# EAGLE design LB_BIT_o13_FAN-v02(rev1) (EAGLE 6.6.0)
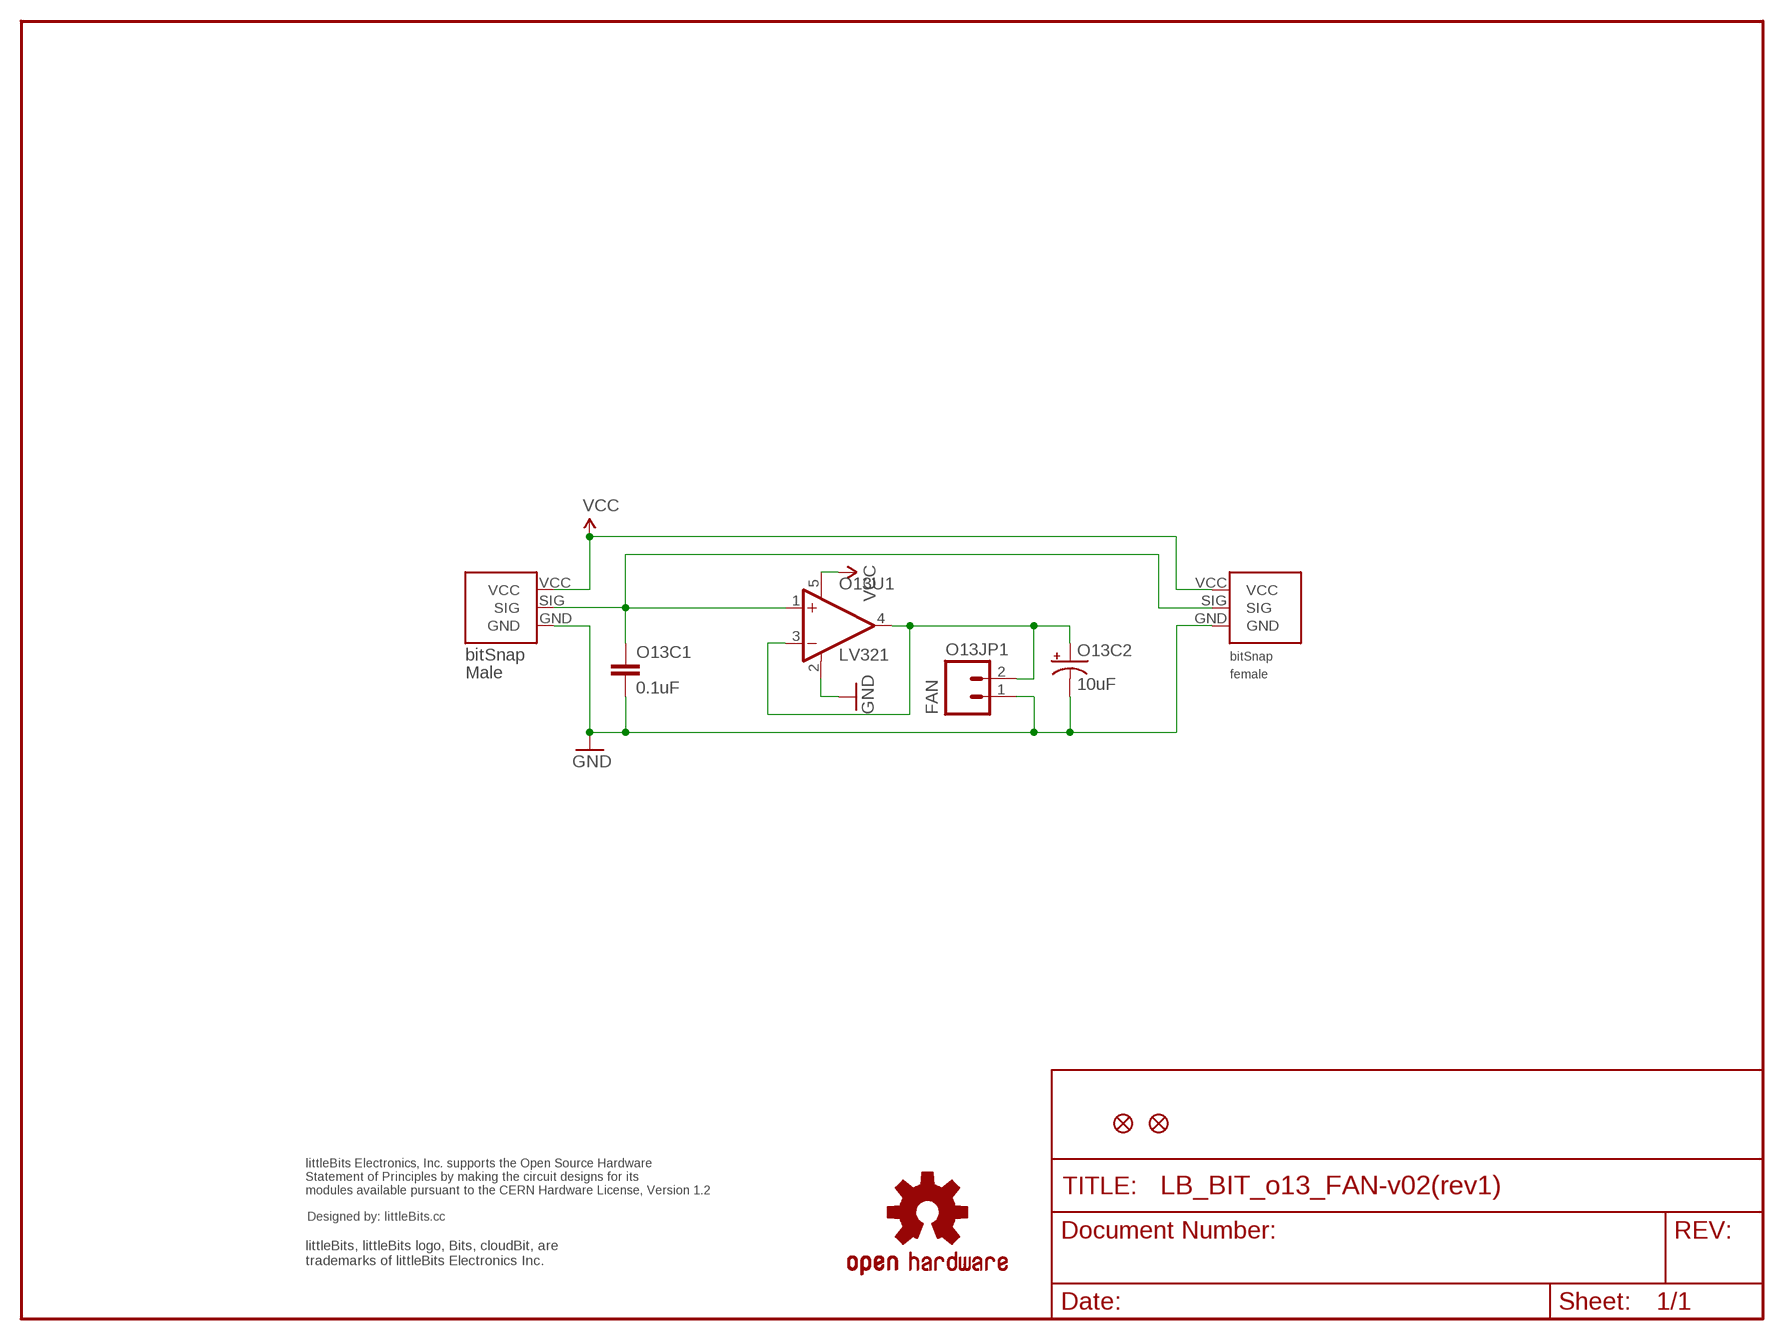
[diagram p0: schematic, sheet 1]

## Parts
JP2  FIDUCIAL1X2  [FIDUCIAL-1X2]
JP3  FIDUCIAL1X2  [FIDUCIAL-1X2]
O13BSF  BITSNAP_FEMALE  [BITSNAP_FEMALE]
O13BSM  BITSNAP_MALE  [BITSNAP_MALE]
O13C1  0.1uF  CAP0603-CAP  [0603-CAP]
O13C2  10uF  CAP_POL1206  [EIA3216]
O13JP1  FAN  M02PTH  [1X02]
O13U1  LV321  [SC70-5]
U$1  OSHWCREDIT  [OSHWCREDIT]
U$5  OSHW-LOGOL  [OSHW-LOGO-L]

## Nets
GND: O13BSF.GND O13BSM.GND O13C1.2 O13C2.C(-) O13JP1.1 O13U1.2(V-)
N$2: O13C2.A(+) O13JP1.2 O13U1.3(-IN) O13U1.4(OUT)
SIG: O13BSF.SIG O13BSM.SIG O13C1.1 O13U1.1(+IN)
VCC: O13BSF.VCC O13BSM.VCC O13U1.5(V+)

## Library data of the parts
JP2 JP3 = SparkFun:FIDUCIAL: Fiducial Alignment Points Various fiducial points for machine vision alignment.
O13BSF = bitSnap:BITSNAP_FEMALE
O13BSM = bitSnap:BITSNAP_MALE
O13C1 = SparkFun:CAP: Capacitor Standard 0603 ceramic capacitor, and 0.1" leaded capacitor.
O13C2 = SparkFun:CAP_POL: Capacitor Polarized These are standard SMD and PTH capacitors. Normally 10uF, 47uF, and 100uF in electrolytic and tantalum varieties. Always verify the external diameter of the through hole cap, it varies with capacity, voltage, and manufacturer. The EIA devices should be standard.
O13JP1 = SparkFun:M02: Header 2 Standard 2-pin 0.1" header. Use with straight break away headers (SKU : PRT-00116), right angle break away headers (PRT-00553), swiss pins (PRT-00743), machine pins (PRT-00117), and female headers (PRT-00115). Molex polarized connector foot print use with SKU : PRT-08233 with associated crimp pins and housings.
O13U1 = LITTLEBITS:LV321
U$1 = LITTLEBITS:OSHWCREDIT
U$5 = SparkFun_NEW:OSHW-LOGO: Open Source Hardware Logo This logo indicates the piece of hardware it is found on incorporates a OSHW license and/or adheres to the definition of open source hardware found here: http://freedomdefined.org/OSHW

## Board
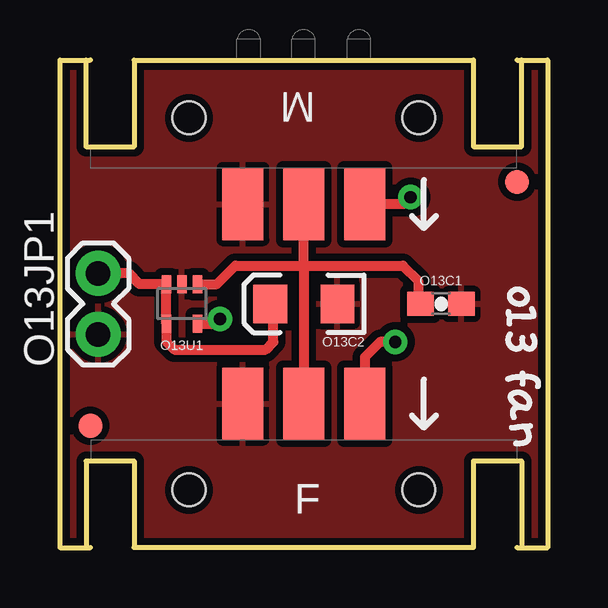
[diagram p1: board, top side]
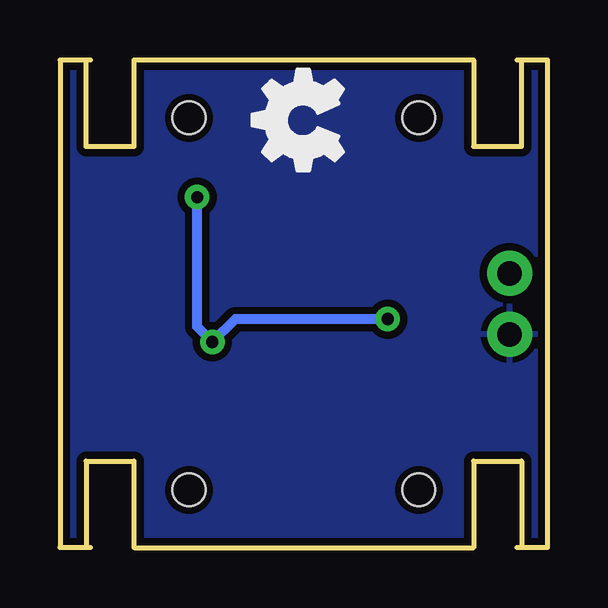
[diagram p2: board, bottom side, seen from below]

Size 20.32 x 20.32 mm. Coordinates in mm from the lower left corner, seen from the top.
Outline: 1.27,0 0,0 0,20.32 1.27,20.32
Outline: 19.05,0 20.32,0 20.32,20.32 19.05,20.32
Copper layers (1*16): Top 0.035mm / dielectric 1.5mm / Bottom 0.035mm
Design rules "default": minimum track width 8mil, minimum drill 20mil, track to track 8mil, track to pad 8mil, pad to pad 8mil, via to via 8mil, smd to smd 8mil, copper to edge 10mil, drill to drill 8mil, minimum pad ring 12mil, minimum via ring 10mil, stop-mask expansion 4mil, vias tented up to drill 25mil, thermal gap 10mil

### Footprints (pad centres in the part's own frame; a part is rotated, then mirrored left to right if it is on the bottom)
FIDUCIAL-1X2 = smd 1 x 1: 1 0,0
BITSNAP_FEMALE = smd 1.7 x 3: GND 6.35,6; SIG 8.89,6; VCC 11.43,6 | hole 1.37: 13.68,2.41; 4.1,2.41
BITSNAP_MALE = smd 1.7 x 3: GND 11.43,6; SIG 8.89,6; VCC 6.35,6 | hole 1.37: 13.68,2.41; 4.1,2.41
0603-CAP = smd 1.1 x 1: 1 -0.85,0; 2 0.85,0
EIA3216 = smd 1.4 x 1.6: A 1.4,0; C -1.4,0
1X02 = drill 1.016 pad 1.88: 1 0,0; 2 2.54,0
SC70-5 = smd 0.4 x 0.75: 1 -0.65,-0.825; 2 0,-0.825; 3 0.65,-0.825; 4 0.65,0.825; 5 -0.65,0.825

### Placement (x,y rotation side)
JP2  19.05,15.24 0 top
JP3  1.27,5.08 0 top
O13BSF  1.27,0 0 top
O13BSM  19.05,20.32 180 top
O13C1  15.88,10.16 0 top
O13C2  10.16,10.16 180 top
O13JP1  1.59,8.89 90 top
O13U1  5.08,10.16 180 top
U$1  -17.78,-21.59 0 top  (outside the outline)
U$2  [O]  18.54,11.05 270 top
U$3  [1]  18.54,10.16 270 top
U$5  -13.97,-8.89 0 top  (outside the outline)
U$6  [OSHW_FILLX150_NOTEXT]  8.51,14.86 0 top
U$7  [3]  18.54,9.14 270 top
U$8  [F]  18.41,7.49 270 top
U$9  [A]  18.41,6.6 270 top
U$10  [N]  18.67,5.21 270 top

### Tracks (layer width: path | path; a pad name or v marks a point on that pad's centre or on a via)
GND
  pour Bottom (isolate 0.305): 0,20.32 0,0 20.32,0 20.32,20.32
  pour Top (isolate 0.305): 0,20.32 0,0 20.32,0 20.32,20.32
N$2
  Top 0.406: O13JP1.2 2.86,11.43 3.3,10.98 O13U1.3 O13U1.4 4.43,8.59 4.76,8.26 8.57,8.26 8.89,8.57 8.89,10.03 O13C2.A
SIG
  Top 0.406: O13U1.1 6.54,10.98 7.3,11.75 10.16,11.75 | 10.16,11.75 O13BSM.SIG | 10.16,11.75 O13BSF.SIG | 10.16,11.75 14.29,11.75 14.92,11.11 14.92,10.26 O13C1.1
VCC  (via drill 0.51)
  Top 0.406: O13U1.5 6.48,9.34 v6.67,9.53 | v13.97,8.57 13.34,8.57 12.7,7.94 O13BSF.VCC | O13BSM.VCC 14.32,14.32 v14.61,14.61
  Bottom 0.406: v6.67,9.53 13.02,9.53 v13.97,8.57 14.61,9.21 v14.61,14.61